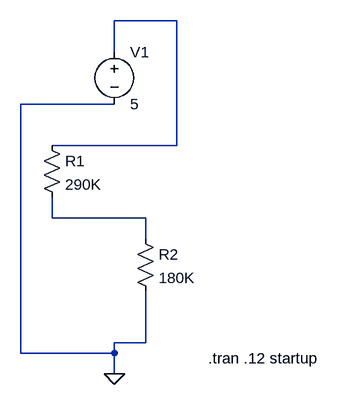
[diagram p0: schematic water_detector_scheme.asc]
water_detector_scheme.asc, the LTspice schematic file:
Version 4
SHEET 1 880 680
WIRE 224 64 128 64
WIRE 128 112 128 64
WIRE 128 192 -16 192
WIRE 224 256 224 64
WIRE 224 256 32 256
WIRE 32 368 32 336
WIRE 176 368 32 368
WIRE 176 400 176 368
WIRE 176 560 176 480
WIRE 176 560 128 560
WIRE -16 576 -16 192
WIRE 128 576 128 560
WIRE 128 576 -16 576
WIRE 128 608 128 576
FLAG 128 608 0
SYMBOL voltage 128 96 R0
SYMATTR InstName V1
SYMATTR Value 5
SYMBOL Res 16 240 R0
SYMATTR InstName R1
SYMATTR Value 290K
SYMBOL Res 160 384 R0
SYMATTR InstName R2
SYMATTR Value 180K
TEXT 272 584 Left 2 !.tran .12 startup

The netlist it stands for:
* water_detector_scheme.asc
V1 N001 0 5
R1 N001 N002 290K
R2 N002 0 180K
.tran .12 startup
.backanno
.end